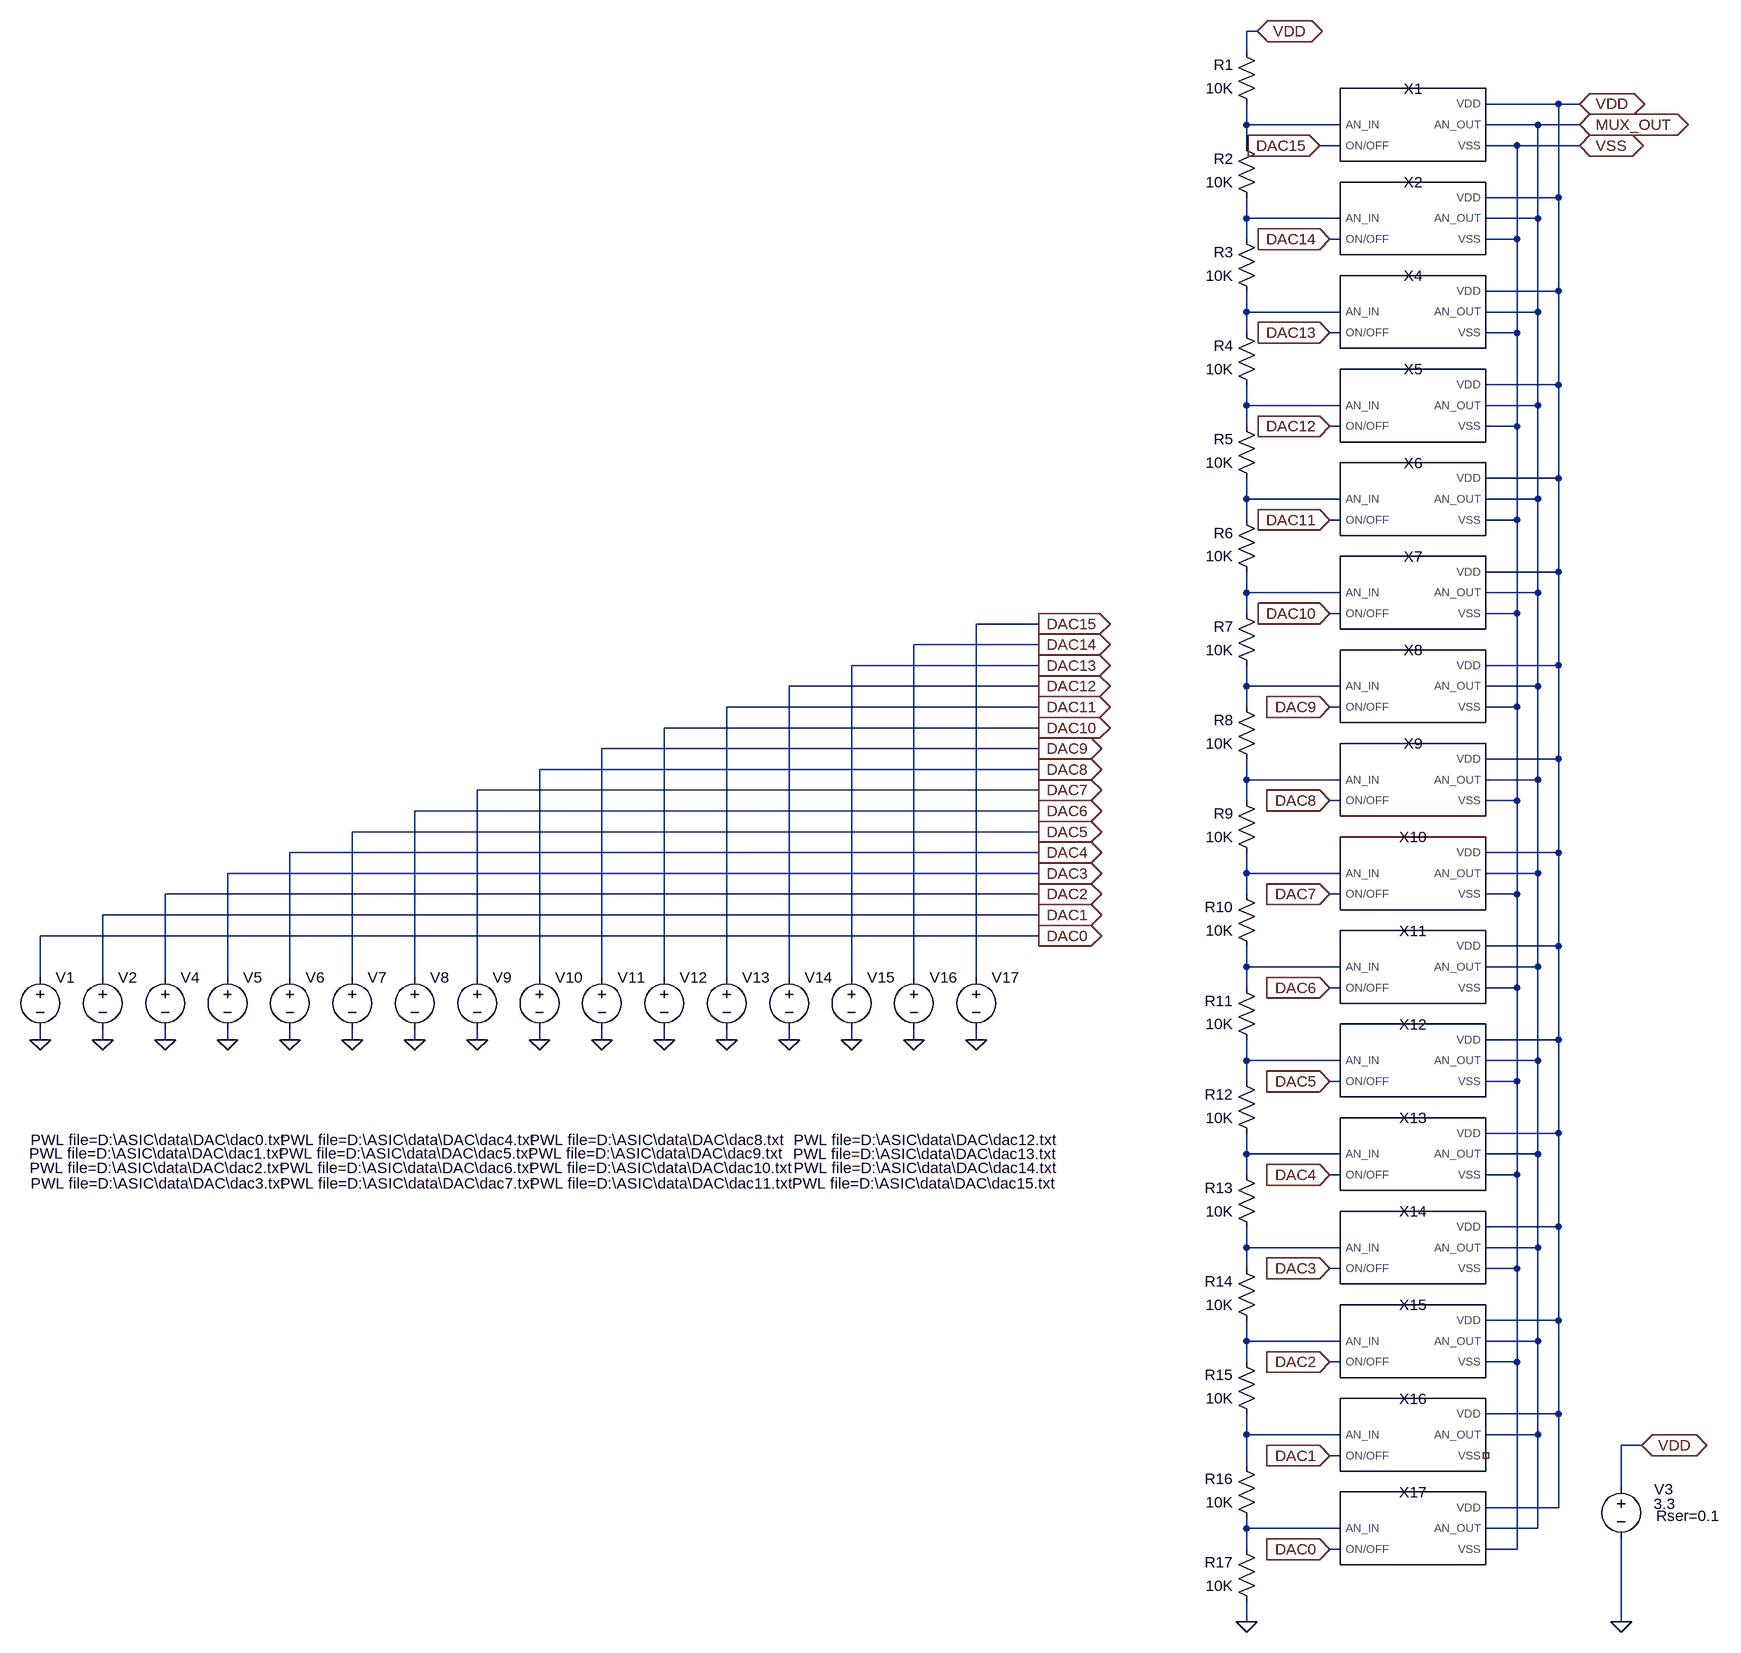
[diagram p0: schematic dac_amux_test.asc]
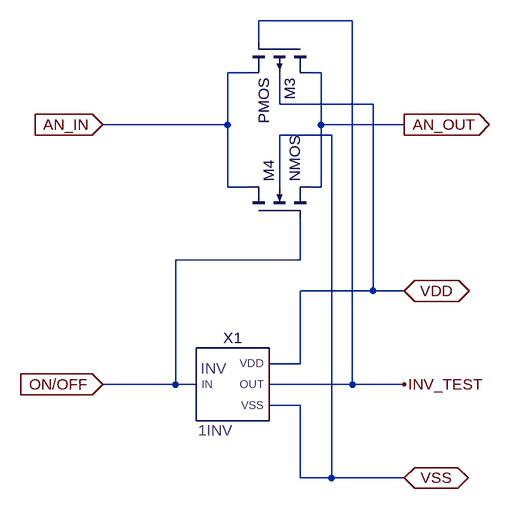
[diagram p1: sub-circuit analog_switch.asc]
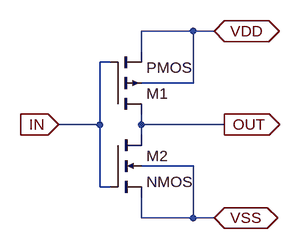
[diagram p2: sub-circuit 1inv.asc]
dac_amux_test.asc, the LTspice schematic file:
Version 4
SHEET 1 2296 1460
WIRE 592 -1008 576 -1008
WIRE 576 -976 576 -1008
WIRE 1056 -896 944 -896
WIRE 1088 -896 1056 -896
WIRE 576 -864 576 -896
WIRE 720 -864 576 -864
WIRE 1024 -864 944 -864
WIRE 1088 -864 1024 -864
WIRE 576 -832 576 -864
WIRE 720 -832 688 -832
WIRE 992 -832 944 -832
WIRE 1088 -832 992 -832
WIRE 1056 -752 1056 -896
WIRE 1056 -752 944 -752
WIRE 576 -720 576 -752
WIRE 720 -720 576 -720
WIRE 1024 -720 1024 -864
WIRE 1024 -720 944 -720
WIRE 576 -688 576 -720
WIRE 720 -688 704 -688
WIRE 992 -688 992 -832
WIRE 992 -688 944 -688
WIRE 1056 -608 1056 -752
WIRE 1056 -608 944 -608
WIRE 576 -576 576 -608
WIRE 720 -576 576 -576
WIRE 1024 -576 1024 -720
WIRE 1024 -576 944 -576
WIRE 576 -544 576 -576
WIRE 720 -544 704 -544
WIRE 992 -544 992 -688
WIRE 992 -544 944 -544
WIRE 1056 -464 1056 -608
WIRE 1056 -464 944 -464
WIRE 576 -432 576 -464
WIRE 720 -432 576 -432
WIRE 1024 -432 1024 -576
WIRE 1024 -432 944 -432
WIRE 576 -400 576 -432
WIRE 720 -400 704 -400
WIRE 992 -400 992 -544
WIRE 992 -400 944 -400
WIRE 1056 -320 1056 -464
WIRE 1056 -320 944 -320
WIRE 576 -288 576 -320
WIRE 720 -288 576 -288
WIRE 1024 -288 1024 -432
WIRE 1024 -288 944 -288
WIRE 576 -256 576 -288
WIRE 720 -256 704 -256
WIRE 992 -256 992 -400
WIRE 992 -256 944 -256
WIRE 1056 -176 1056 -320
WIRE 1056 -176 944 -176
WIRE 576 -144 576 -176
WIRE 720 -144 576 -144
WIRE 1024 -144 1024 -288
WIRE 1024 -144 944 -144
WIRE 576 -112 576 -144
WIRE 720 -112 704 -112
WIRE 992 -112 992 -256
WIRE 992 -112 944 -112
WIRE 256 -96 160 -96
WIRE 256 -64 64 -64
WIRE 256 -32 -32 -32
WIRE 1056 -32 1056 -176
WIRE 1056 -32 944 -32
WIRE 256 0 -128 0
WIRE 576 0 576 -32
WIRE 720 0 576 0
WIRE 1024 0 1024 -144
WIRE 1024 0 944 0
WIRE 256 32 -224 32
WIRE 576 32 576 0
WIRE 720 32 704 32
WIRE 992 32 992 -112
WIRE 992 32 944 32
WIRE 256 64 -320 64
WIRE 256 96 -416 96
WIRE 1056 112 1056 -32
WIRE 1056 112 944 112
WIRE 256 128 -512 128
WIRE 576 144 576 112
WIRE 720 144 576 144
WIRE 1024 144 1024 0
WIRE 1024 144 944 144
WIRE 256 160 -608 160
WIRE 576 176 576 144
WIRE 720 176 704 176
WIRE 992 176 992 32
WIRE 992 176 944 176
WIRE 256 192 -704 192
WIRE 256 224 -800 224
WIRE 256 256 -896 256
WIRE 1056 256 1056 112
WIRE 1056 256 944 256
WIRE 256 288 -992 288
WIRE 576 288 576 256
WIRE 720 288 576 288
WIRE 1024 288 1024 144
WIRE 1024 288 944 288
WIRE 256 320 -1088 320
WIRE 576 320 576 288
WIRE 720 320 704 320
WIRE 992 320 992 176
WIRE 992 320 944 320
WIRE 256 352 -1184 352
WIRE 256 384 -1280 384
WIRE 1056 400 1056 256
WIRE 1056 400 944 400
WIRE 576 432 576 400
WIRE 720 432 576 432
WIRE 1024 432 1024 288
WIRE 1024 432 944 432
WIRE -1280 448 -1280 384
WIRE -1184 448 -1184 352
WIRE -1088 448 -1088 320
WIRE -992 448 -992 288
WIRE -896 448 -896 256
WIRE -800 448 -800 224
WIRE -704 448 -704 192
WIRE -608 448 -608 160
WIRE -512 448 -512 128
WIRE -416 448 -416 96
WIRE -320 448 -320 64
WIRE -224 448 -224 32
WIRE -128 448 -128 0
WIRE -32 448 -32 -32
WIRE 64 448 64 -64
WIRE 160 448 160 -96
WIRE 576 464 576 432
WIRE 720 464 704 464
WIRE 992 464 992 320
WIRE 992 464 944 464
WIRE -1280 544 -1280 528
WIRE -1184 544 -1184 528
WIRE -1088 544 -1088 528
WIRE -992 544 -992 528
WIRE -896 544 -896 528
WIRE -800 544 -800 528
WIRE -704 544 -704 528
WIRE -608 544 -608 528
WIRE -512 544 -512 528
WIRE -416 544 -416 528
WIRE -320 544 -320 528
WIRE -224 544 -224 528
WIRE -128 544 -128 528
WIRE -32 544 -32 528
WIRE 64 544 64 528
WIRE 160 544 160 528
WIRE 1056 544 1056 400
WIRE 1056 544 944 544
WIRE 576 576 576 544
WIRE 720 576 576 576
WIRE 1024 576 1024 432
WIRE 1024 576 944 576
WIRE 576 608 576 576
WIRE 720 608 704 608
WIRE 992 608 992 464
WIRE 992 608 944 608
WIRE 1056 688 1056 544
WIRE 1056 688 944 688
WIRE 576 720 576 688
WIRE 720 720 576 720
WIRE 1024 720 1024 576
WIRE 1024 720 944 720
WIRE 576 752 576 720
WIRE 720 752 704 752
WIRE 992 752 992 608
WIRE 992 752 944 752
WIRE 1056 832 1056 688
WIRE 1056 832 944 832
WIRE 576 864 576 832
WIRE 720 864 576 864
WIRE 1024 864 1024 720
WIRE 1024 864 944 864
WIRE 576 896 576 864
WIRE 720 896 704 896
WIRE 992 896 992 752
WIRE 992 896 944 896
WIRE 1056 976 1056 832
WIRE 1056 976 944 976
WIRE 576 1008 576 976
WIRE 720 1008 576 1008
WIRE 1024 1008 1024 864
WIRE 1024 1008 944 1008
WIRE 576 1040 576 1008
WIRE 720 1040 704 1040
WIRE 992 1040 992 896
WIRE 992 1040 944 1040
WIRE 1056 1120 1056 976
WIRE 1056 1120 944 1120
WIRE 576 1152 576 1120
WIRE 720 1152 576 1152
WIRE 1024 1152 1024 1008
WIRE 1024 1152 944 1152
WIRE 1184 1168 1152 1168
WIRE 720 1184 704 1184
WIRE 576 1200 576 1152
WIRE 1152 1232 1152 1168
WIRE 1056 1264 1056 1120
WIRE 1056 1264 944 1264
WIRE 576 1296 576 1280
WIRE 720 1296 576 1296
WIRE 1024 1296 1024 1152
WIRE 1024 1296 944 1296
WIRE 576 1328 576 1296
WIRE 720 1328 704 1328
WIRE 992 1328 992 1040
WIRE 992 1328 944 1328
WIRE 576 1440 576 1408
WIRE 1152 1440 1152 1312
FLAG 1152 1440 0
FLAG 1184 1168 VDD
IOPIN 1184 1168 BiDir
FLAG -1280 544 0
FLAG -1184 544 0
FLAG -1088 544 0
FLAG -992 544 0
FLAG 1088 -896 VDD
IOPIN 1088 -896 BiDir
FLAG 1088 -832 VSS
IOPIN 1088 -832 BiDir
FLAG 1088 -864 MUX_OUT
IOPIN 1088 -864 BiDir
FLAG 688 -832 DAC15
IOPIN 688 -832 In
FLAG 704 -544 DAC13
IOPIN 704 -544 In
FLAG 704 -256 DAC11
IOPIN 704 -256 In
FLAG 704 32 DAC9
IOPIN 704 32 In
FLAG 704 -112 DAC10
IOPIN 704 -112 In
FLAG 704 -400 DAC12
IOPIN 704 -400 In
FLAG 704 -688 DAC14
IOPIN 704 -688 In
FLAG 704 176 DAC8
IOPIN 704 176 In
FLAG 704 320 DAC7
IOPIN 704 320 In
FLAG 704 464 DAC6
IOPIN 704 464 In
FLAG 704 608 DAC5
IOPIN 704 608 In
FLAG 704 752 DAC4
IOPIN 704 752 In
FLAG 704 896 DAC3
IOPIN 704 896 In
FLAG 704 1040 DAC2
IOPIN 704 1040 In
FLAG 704 1184 DAC1
IOPIN 704 1184 In
FLAG 704 1328 DAC0
IOPIN 704 1328 In
FLAG 576 1440 0
FLAG 592 -1008 VDD
IOPIN 592 -1008 BiDir
FLAG 256 384 DAC0
IOPIN 256 384 Out
FLAG 256 352 DAC1
IOPIN 256 352 Out
FLAG 256 320 DAC2
IOPIN 256 320 Out
FLAG 256 288 DAC3
IOPIN 256 288 Out
FLAG 256 256 DAC4
IOPIN 256 256 Out
FLAG 256 224 DAC5
IOPIN 256 224 Out
FLAG 256 192 DAC6
IOPIN 256 192 Out
FLAG 256 160 DAC7
IOPIN 256 160 Out
FLAG 256 128 DAC8
IOPIN 256 128 Out
FLAG 256 96 DAC9
IOPIN 256 96 Out
FLAG 256 64 DAC10
IOPIN 256 64 Out
FLAG 256 32 DAC11
IOPIN 256 32 Out
FLAG 256 0 DAC12
IOPIN 256 0 Out
FLAG 256 -32 DAC13
IOPIN 256 -32 Out
FLAG 256 -64 DAC14
IOPIN 256 -64 Out
FLAG 256 -96 DAC15
IOPIN 256 -96 Out
FLAG -896 544 0
FLAG -800 544 0
FLAG -704 544 0
FLAG -608 544 0
FLAG -512 544 0
FLAG -416 544 0
FLAG -320 544 0
FLAG -224 544 0
FLAG -128 544 0
FLAG -32 544 0
FLAG 64 544 0
FLAG 160 544 0
SYMBOL voltage 1152 1216 R0
WINDOW 123 0 0 Left 2
WINDOW 39 54 61 Left 2
WINDOW 0 51 20 Left 2
WINDOW 3 50 42 Left 2
SYMATTR SpiceLine Rser=0.1
SYMATTR InstName V3
SYMATTR Value 3.3
SYMBOL voltage -1280 432 R0
WINDOW 3 -15 266 Left 2
WINDOW 123 0 0 Left 2
WINDOW 39 0 0 Left 2
SYMATTR Value PWL file=D:\ASIC\data\DAC\dac0.txt
SYMATTR InstName V1
SYMBOL voltage -1184 432 R0
WINDOW 3 -113 287 Left 2
WINDOW 123 0 0 Left 2
WINDOW 39 0 0 Left 2
SYMATTR Value PWL file=D:\ASIC\data\DAC\dac1.txt
SYMATTR InstName V2
SYMBOL voltage -1088 432 R0
WINDOW 3 -208 309 Left 2
WINDOW 123 0 0 Left 2
WINDOW 39 0 0 Left 2
SYMATTR Value PWL file=D:\ASIC\data\DAC\dac2.txt
SYMATTR InstName V4
SYMBOL voltage -992 432 R0
WINDOW 3 -303 333 Left 2
WINDOW 123 0 0 Left 2
WINDOW 39 0 0 Left 2
SYMATTR Value PWL file=D:\ASIC\data\DAC\dac3.txt
SYMATTR InstName V5
SYMBOL ANALOG_SWITCH 832 -848 R0
WINDOW 0 0 -56 Bottom 2
SYMATTR InstName X1
SYMATTR SpiceLine L=110n W=180n
SYMBOL ANALOG_SWITCH 832 -704 R0
WINDOW 0 0 -56 Bottom 2
SYMATTR InstName X2
SYMATTR SpiceLine L=110n W=180n
SYMBOL ANALOG_SWITCH 832 -560 R0
WINDOW 0 0 -56 Bottom 2
SYMATTR InstName X4
SYMATTR SpiceLine L=110n W=180n
SYMBOL ANALOG_SWITCH 832 -416 R0
WINDOW 0 0 -56 Bottom 2
SYMATTR InstName X5
SYMATTR SpiceLine L=110n W=180n
SYMBOL ANALOG_SWITCH 832 -272 R0
WINDOW 0 0 -56 Bottom 2
SYMATTR InstName X6
SYMATTR SpiceLine L=110n W=180n
SYMBOL ANALOG_SWITCH 832 -128 R0
WINDOW 0 0 -56 Bottom 2
SYMATTR InstName X7
SYMATTR SpiceLine L=110n W=180n
SYMBOL ANALOG_SWITCH 832 16 R0
WINDOW 0 0 -56 Bottom 2
SYMATTR InstName X8
SYMATTR SpiceLine L=110n W=180n
SYMBOL ANALOG_SWITCH 832 160 R0
WINDOW 0 0 -56 Bottom 2
SYMATTR InstName X9
SYMATTR SpiceLine L=110n W=180n
SYMBOL ANALOG_SWITCH 832 304 R0
WINDOW 0 0 -56 Bottom 2
SYMATTR InstName X10
SYMATTR SpiceLine L=110n W=180n
SYMBOL ANALOG_SWITCH 832 448 R0
WINDOW 0 0 -56 Bottom 2
SYMATTR InstName X11
SYMATTR SpiceLine L=110n W=180n
SYMBOL ANALOG_SWITCH 832 592 R0
WINDOW 0 0 -56 Bottom 2
SYMATTR InstName X12
SYMATTR SpiceLine L=110n W=180n
SYMBOL ANALOG_SWITCH 832 736 R0
WINDOW 0 0 -56 Bottom 2
SYMATTR InstName X13
SYMATTR SpiceLine L=110n W=180n
SYMBOL ANALOG_SWITCH 832 880 R0
WINDOW 0 0 -56 Bottom 2
SYMATTR InstName X14
SYMATTR SpiceLine L=110n W=180n
SYMBOL ANALOG_SWITCH 832 1024 R0
WINDOW 0 0 -56 Bottom 2
SYMATTR InstName X15
SYMATTR SpiceLine L=110n W=180n
SYMBOL ANALOG_SWITCH 832 1168 R0
WINDOW 0 0 -56 Bottom 2
SYMATTR InstName X16
SYMATTR SpiceLine L=110n W=180n
SYMBOL ANALOG_SWITCH 832 1312 R0
WINDOW 0 0 -56 Bottom 2
SYMATTR InstName X17
SYMATTR SpiceLine L=110n W=180n
SYMBOL res 592 272 R180
WINDOW 0 36 76 Left 2
WINDOW 3 36 40 Left 2
SYMATTR InstName R9
SYMATTR Value 10K
SYMBOL res 592 416 R180
WINDOW 0 36 76 Left 2
WINDOW 3 36 40 Left 2
SYMATTR InstName R10
SYMATTR Value 10K
SYMBOL res 592 560 R180
WINDOW 0 36 76 Left 2
WINDOW 3 36 40 Left 2
SYMATTR InstName R11
SYMATTR Value 10K
SYMBOL res 592 704 R180
WINDOW 0 36 76 Left 2
WINDOW 3 36 40 Left 2
SYMATTR InstName R12
SYMATTR Value 10K
SYMBOL res 592 848 R180
WINDOW 0 36 76 Left 2
WINDOW 3 36 40 Left 2
SYMATTR InstName R13
SYMATTR Value 10K
SYMBOL res 592 992 R180
WINDOW 0 36 76 Left 2
WINDOW 3 36 40 Left 2
SYMATTR InstName R14
SYMATTR Value 10K
SYMBOL res 592 1136 R180
WINDOW 0 36 76 Left 2
WINDOW 3 36 40 Left 2
SYMATTR InstName R15
SYMATTR Value 10K
SYMBOL res 592 1296 R180
WINDOW 0 36 76 Left 2
WINDOW 3 36 40 Left 2
SYMATTR InstName R16
SYMATTR Value 10K
SYMBOL res 592 -880 R180
WINDOW 0 36 76 Left 2
WINDOW 3 36 40 Left 2
SYMATTR InstName R1
SYMATTR Value 10K
SYMBOL res 592 -736 R180
WINDOW 0 36 76 Left 2
WINDOW 3 36 40 Left 2
SYMATTR InstName R2
SYMATTR Value 10K
SYMBOL res 592 -592 R180
WINDOW 0 36 76 Left 2
WINDOW 3 36 40 Left 2
SYMATTR InstName R3
SYMATTR Value 10K
SYMBOL res 592 -448 R180
WINDOW 0 36 76 Left 2
WINDOW 3 36 40 Left 2
SYMATTR InstName R4
SYMATTR Value 10K
SYMBOL res 592 -304 R180
WINDOW 0 36 76 Left 2
WINDOW 3 36 40 Left 2
SYMATTR InstName R5
SYMATTR Value 10K
SYMBOL res 592 -160 R180
WINDOW 0 36 76 Left 2
WINDOW 3 36 40 Left 2
SYMATTR InstName R6
SYMATTR Value 10K
SYMBOL res 592 -16 R180
WINDOW 0 36 76 Left 2
WINDOW 3 36 40 Left 2
SYMATTR InstName R7
SYMATTR Value 10K
SYMBOL res 592 128 R180
WINDOW 0 36 76 Left 2
WINDOW 3 36 40 Left 2
SYMATTR InstName R8
SYMATTR Value 10K
SYMBOL res 592 1424 R180
WINDOW 0 36 76 Left 2
WINDOW 3 36 40 Left 2
SYMATTR InstName R17
SYMATTR Value 10K
SYMBOL voltage -896 432 R0
WINDOW 3 -15 266 Left 2
WINDOW 123 0 0 Left 2
WINDOW 39 0 0 Left 2
SYMATTR Value PWL file=D:\ASIC\data\DAC\dac4.txt
SYMATTR InstName V6
SYMBOL voltage -800 432 R0
WINDOW 3 -113 287 Left 2
WINDOW 123 0 0 Left 2
WINDOW 39 0 0 Left 2
SYMATTR Value PWL file=D:\ASIC\data\DAC\dac5.txt
SYMATTR InstName V7
SYMBOL voltage -704 432 R0
WINDOW 3 -208 309 Left 2
WINDOW 123 0 0 Left 2
WINDOW 39 0 0 Left 2
SYMATTR Value PWL file=D:\ASIC\data\DAC\dac6.txt
SYMATTR InstName V8
SYMBOL voltage -608 432 R0
WINDOW 3 -303 333 Left 2
WINDOW 123 0 0 Left 2
WINDOW 39 0 0 Left 2
SYMATTR Value PWL file=D:\ASIC\data\DAC\dac7.txt
SYMATTR InstName V9
SYMBOL voltage -512 432 R0
WINDOW 3 -15 266 Left 2
WINDOW 123 0 0 Left 2
WINDOW 39 0 0 Left 2
SYMATTR Value PWL file=D:\ASIC\data\DAC\dac8.txt
SYMATTR InstName V10
SYMBOL voltage -416 432 R0
WINDOW 3 -113 287 Left 2
WINDOW 123 0 0 Left 2
WINDOW 39 0 0 Left 2
SYMATTR Value PWL file=D:\ASIC\data\DAC\dac9.txt
SYMATTR InstName V11
SYMBOL voltage -320 432 R0
WINDOW 3 -208 309 Left 2
WINDOW 123 0 0 Left 2
WINDOW 39 0 0 Left 2
SYMATTR Value PWL file=D:\ASIC\data\DAC\dac10.txt
SYMATTR InstName V12
SYMBOL voltage -224 432 R0
WINDOW 3 -303 333 Left 2
WINDOW 123 0 0 Left 2
WINDOW 39 0 0 Left 2
SYMATTR Value PWL file=D:\ASIC\data\DAC\dac11.txt
SYMATTR InstName V13
SYMBOL voltage -128 432 R0
WINDOW 3 7 266 Left 2
WINDOW 123 0 0 Left 2
WINDOW 39 0 0 Left 2
SYMATTR Value PWL file=D:\ASIC\data\DAC\dac12.txt
SYMATTR InstName V14
SYMBOL voltage -32 432 R0
WINDOW 3 -90 288 Left 2
WINDOW 123 0 0 Left 2
WINDOW 39 0 0 Left 2
SYMATTR Value PWL file=D:\ASIC\data\DAC\dac13.txt
SYMATTR InstName V15
SYMBOL voltage 64 432 R0
WINDOW 3 -185 309 Left 2
WINDOW 123 0 0 Left 2
WINDOW 39 0 0 Left 2
SYMATTR Value PWL file=D:\ASIC\data\DAC\dac14.txt
SYMATTR InstName V16
SYMBOL voltage 160 432 R0
WINDOW 3 -283 333 Left 2
WINDOW 123 0 0 Left 2
WINDOW 39 0 0 Left 2
SYMATTR Value PWL file=D:\ASIC\data\DAC\dac15.txt
SYMATTR InstName V17

analog_switch.asc, the sub-circuit schematic file:
Version 4
SHEET 1 880 680
WIRE 336 -480 192 -480
WIRE 192 -448 192 -480
WIRE 176 -400 144 -400
WIRE 288 -400 272 -400
WIRE 224 -352 224 -400
WIRE 368 -352 224 -352
WIRE 144 -320 144 -400
WIRE 144 -320 -48 -320
WIRE 288 -320 288 -400
WIRE 416 -320 288 -320
WIRE 304 -304 224 -304
WIRE 144 -224 144 -320
WIRE 176 -224 144 -224
WIRE 224 -224 224 -304
WIRE 288 -224 288 -320
WIRE 288 -224 272 -224
WIRE 256 -112 256 -176
WIRE 256 -112 64 -112
WIRE 368 -64 368 -352
WIRE 368 -64 256 -64
WIRE 416 -64 368 -64
WIRE 256 48 256 -64
WIRE 256 48 208 48
WIRE 64 80 64 -112
WIRE 64 80 -48 80
WIRE 96 80 64 80
WIRE 336 80 336 -480
WIRE 336 80 208 80
WIRE 416 80 336 80
WIRE 256 112 208 112
WIRE 256 224 256 112
WIRE 304 224 304 -304
WIRE 304 224 256 224
WIRE 416 224 304 224
FLAG -48 -320 AN_IN
IOPIN -48 -320 In
FLAG 416 -320 AN_OUT
IOPIN 416 -320 Out
FLAG 416 80 INV_TEST
FLAG 416 -64 VDD
IOPIN 416 -64 BiDir
FLAG 416 224 VSS
IOPIN 416 224 BiDir
FLAG -48 80 ON/OFF
IOPIN -48 80 In
SYMBOL pmos4 272 -448 R90
SYMATTR InstName M3
SYMATTR Value2 l=L w=W
SYMBOL nmos4 176 -176 R270
SYMATTR InstName M4
SYMATTR Value2 l=L w=W
SYMBOL 1INV 144 80 R0
SYMATTR InstName X1

1inv.asc, the sub-circuit schematic file:
Version 4
SHEET 1 880 680
WIRE 224 -16 144 -16
WIRE 256 -16 224 -16
WIRE 144 16 144 -16
WIRE 96 32 80 32
WIRE 224 64 224 -16
WIRE 224 64 144 64
WIRE 80 128 80 32
WIRE 80 128 16 128
WIRE 144 128 144 112
WIRE 272 128 144 128
WIRE 144 144 144 128
WIRE 224 192 144 192
WIRE 80 224 80 128
WIRE 96 224 80 224
WIRE 144 272 144 240
WIRE 224 272 224 192
WIRE 224 272 144 272
WIRE 256 272 224 272
FLAG 16 128 IN
IOPIN 16 128 In
FLAG 272 128 OUT
IOPIN 272 128 Out
FLAG 256 -16 VDD
IOPIN 256 -16 BiDir
FLAG 256 272 VSS
IOPIN 256 272 BiDir
SYMBOL pmos4 96 112 M180
SYMATTR InstName M1
SYMATTR Value2 l=110nM w=180nM
SYMBOL nmos4 96 144 R0
SYMATTR InstName M2
SYMATTR Value2 l=110nM w=180nM

The netlist it stands for:
* dac_amux_test.asc
V3 VDD 0 3.3 Rser=0.1
V1 DAC0 0 PWL file=D:\ASIC\data\DAC\dac0.txt
V2 DAC1 0 PWL file=D:\ASIC\data\DAC\dac1.txt
V4 DAC2 0 PWL file=D:\ASIC\data\DAC\dac2.txt
V5 DAC3 0 PWL file=D:\ASIC\data\DAC\dac3.txt
XX1 N001 DAC15 MUX_OUT VDD VSS analog_switch params: L=110n W=180n
XX2 N002 DAC14 MUX_OUT VDD VSS analog_switch params: L=110n W=180n
XX4 N003 DAC13 MUX_OUT VDD VSS analog_switch params: L=110n W=180n
XX5 N004 DAC12 MUX_OUT VDD VSS analog_switch params: L=110n W=180n
XX6 N005 DAC11 MUX_OUT VDD VSS analog_switch params: L=110n W=180n
XX7 N006 DAC10 MUX_OUT VDD VSS analog_switch params: L=110n W=180n
XX8 N007 DAC9 MUX_OUT VDD VSS analog_switch params: L=110n W=180n
XX9 N008 DAC8 MUX_OUT VDD VSS analog_switch params: L=110n W=180n
XX10 N009 DAC7 MUX_OUT VDD VSS analog_switch params: L=110n W=180n
XX11 N010 DAC6 MUX_OUT VDD VSS analog_switch params: L=110n W=180n
XX12 N011 DAC5 MUX_OUT VDD VSS analog_switch params: L=110n W=180n
XX13 N012 DAC4 MUX_OUT VDD VSS analog_switch params: L=110n W=180n
XX14 N013 DAC3 MUX_OUT VDD VSS analog_switch params: L=110n W=180n
XX15 N014 DAC2 MUX_OUT VDD VSS analog_switch params: L=110n W=180n
XX16 N015 DAC1 MUX_OUT VDD NC_01 analog_switch params: L=110n W=180n
XX17 N016 DAC0 MUX_OUT VDD VSS analog_switch params: L=110n W=180n
R9 N009 N008 10K
R10 N010 N009 10K
R11 N011 N010 10K
R12 N012 N011 10K
R13 N013 N012 10K
R14 N014 N013 10K
R15 N015 N014 10K
R16 N016 N015 10K
R1 N001 VDD 10K
R2 N002 N001 10K
R3 N003 N002 10K
R4 N004 N003 10K
R5 N005 N004 10K
R6 N006 N005 10K
R7 N007 N006 10K
R8 N008 N007 10K
R17 0 N016 10K
V6 DAC4 0 PWL file=D:\ASIC\data\DAC\dac4.txt
V7 DAC5 0 PWL file=D:\ASIC\data\DAC\dac5.txt
V8 DAC6 0 PWL file=D:\ASIC\data\DAC\dac6.txt
V9 DAC7 0 PWL file=D:\ASIC\data\DAC\dac7.txt
V10 DAC8 0 PWL file=D:\ASIC\data\DAC\dac8.txt
V11 DAC9 0 PWL file=D:\ASIC\data\DAC\dac9.txt
V12 DAC10 0 PWL file=D:\ASIC\data\DAC\dac10.txt
V13 DAC11 0 PWL file=D:\ASIC\data\DAC\dac11.txt
V14 DAC12 0 PWL file=D:\ASIC\data\DAC\dac12.txt
V15 DAC13 0 PWL file=D:\ASIC\data\DAC\dac13.txt
V16 DAC14 0 PWL file=D:\ASIC\data\DAC\dac14.txt
V17 DAC15 0 PWL file=D:\ASIC\data\DAC\dac15.txt

* block symbol definitions
.subckt analog_switch AN_IN ON/OFF AN_OUT VDD VSS
M3 AN_OUT INV_TEST AN_IN VDD PMOS l=L w=W
M4 AN_IN ON/OFF AN_OUT VSS NMOS l=L w=W
XX1 ON/OFF INV_TEST VDD VSS 1inv
.ends analog_switch

.subckt 1inv IN OUT VDD VSS
M1 OUT IN VDD VDD PMOS l=110nM w=180nM
M2 OUT IN VSS VSS NMOS l=110nM w=180nM
.ends 1inv

.model NMOS NMOS
.model PMOS PMOS
.lib standard.mos
.backanno
.end